# Altium schematic sheet Transmitter_PCB.SchDoc
size A4
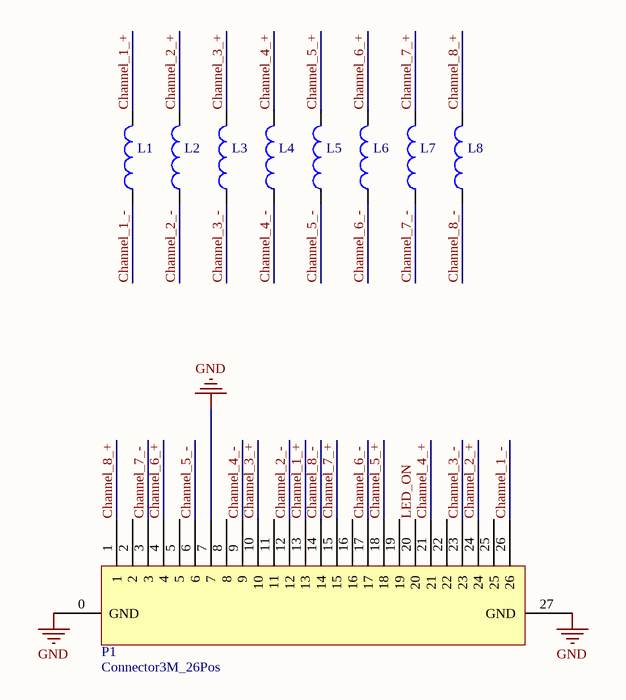
[diagram p0: Transmitter_PCB.SchDoc]

## Parts
L1  (no value)  [TRANSMITTER_COIL_UCC_ORIGINAL]
L2  (no value)  [TRANSMITTER_COIL_UCC_ORIGINAL]
L3  (no value)  [TRANSMITTER_COIL_UCC_ORIGINAL]
L4  (no value)  [TRANSMITTER_COIL_UCC_ORIGINAL]
L5  (no value)  [TRANSMITTER_COIL_UCC_ORIGINAL]
L6  (no value)  [TRANSMITTER_COIL_UCC_ORIGINAL]
L7  (no value)  [TRANSMITTER_COIL_UCC_ORIGINAL]
L8  (no value)  [TRANSMITTER_COIL_UCC_ORIGINAL]
P1  Connector3M_26Pos  [Connector_3M_26Pos]

## Nets
GND: P1.0(GND) P1.7 P1.27(GND)
Channel_1_+: L1.2 P1.13
Channel_1_-: L1.1 P1.26
Channel_2_+: L2.2 P1.24
Channel_2_-: L2.1 P1.12
Channel_3_+: L3.2 P1.10
Channel_3_-: L3.1 P1.23
Channel_4_+: L4.2 P1.21
Channel_4_-: L4.1 P1.9
Channel_5_+: L5.2 P1.18
Channel_5_-: L5.1 P1.6
Channel_6_+: L6.2 P1.4
Channel_6_-: L6.1 P1.17
Channel_7_+: L7.2 P1.15
Channel_7_-: L7.1 P1.3
Channel_8_+: L8.2 P1.1
Channel_8_-: L8.1 P1.14
LED_ON: P1.20

Not connected (* = marked no-connect by the designer): P1 2 5 8 11 16 19 22 25

## Library data of the parts
L1-L8 = TRANSMITTER_COIL_UCC_ORIGINAL
P1 = Connector3M_26Pos: Published: 8-Jun-2000; LatestRevisionDate: 23-02-1017; LatestRevisionNote: IPC-7351 Footprint Added.; PackageReference: J1-0603; Publisher: Altium Limited; PackageDescription: Connector